# Altium schematic sheet MCU - FLASH.SchDoc
size A4; SheetNumber: 7; SheetTotal: 8
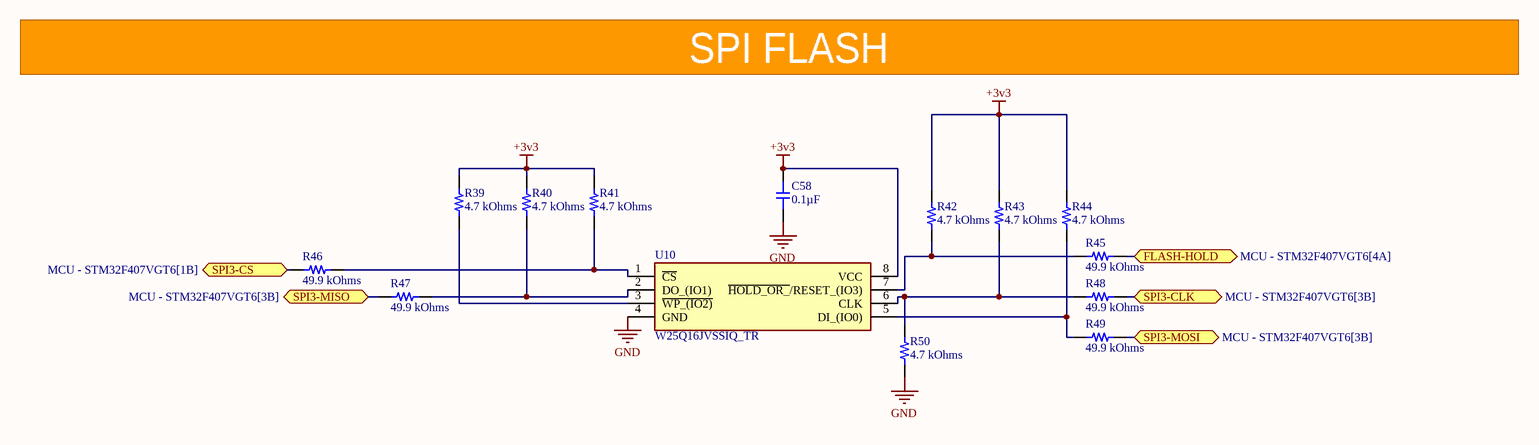
[diagram p0: MCU - FLASH.SchDoc]

## Parts
C58  0.1µF  [0603_Footprint]
R39  4.7 kOhms  [0603_RES]
R40  4.7 kOhms  [0603_RES]
R41  4.7 kOhms  [0603_RES]
R42  4.7 kOhms  [0603_RES]
R43  4.7 kOhms  [0603_RES]
R44  4.7 kOhms  [0603_RES]
R45  49.9 kOhms  [0603_RES]
R46  49.9 kOhms  [0603_RES]
R47  49.9 kOhms  [0603_RES]
R48  49.9 kOhms  [0603_RES]
R49  49.9 kOhms  [0603_RES]
R50  4.7 kOhms  [0603_RES]
U10  W25Q16JVSSIQ_TR  [SOIC127P790X216-8N]

## Ports
FLASH-HOLD (bidir, see MCU - STM32F407VGT6[4A]), SPI3-CLK (bidir, see MCU - STM32F407VGT6[3B]), SPI3-CS (bidir, see MCU - STM32F407VGT6[1B]), SPI3-MISO (bidir, see MCU - STM32F407VGT6[3B]), SPI3-MOSI (bidir, see MCU - STM32F407VGT6[3B])

## Nets
+3v3: C58.1 R39.2 R40.2 R41.2 R42.2 R43.2 R44.2 U10.8(VCC)
GND: C58.2 R50.1 U10.4(GND)
FLASH-HOLD: R45.2 ; port FLASH-HOLD
SPI3-CLK: R48.2 ; port SPI3-CLK
SPI3-CS: R46.1 ; port SPI3-CS
SPI3-MISO: R47.1 ; port SPI3-MISO
SPI3-MOSI: R49.2 ; port SPI3-MOSI
NetR39_1: R39.1 U10.3(~{WP_(IO2)})
NetR40_1: R40.1 R47.2 U10.2(DO_(IO1))
NetR41_1: R41.1 R46.2 U10.1(~{CS})
NetR42_1: R42.1 R45.1 U10.7(~{HOLD_OR_}/RESET_(IO3))
NetR43_1: R43.1 R48.1 R50.2 U10.6(CLK)
NetR44_1: R44.1 R49.1 U10.5(DI_(IO0))

## Notes on the sheet
- SPI FLASH

## Library data of the parts
C58 = 0.1uF 0603 Surface Capacitor
R39-R44 R50 = 4.7 kOhms 0603
R45-R49 = 49.9 kOhms 0603
U10 = W25Q16JVSSIQ_TR: Integrated Circuit; Manufacturer_Name: Winbond; Manufacturer_Part_Number: W25Q16JVSSIQ TR; Datasheet Link: https://www.winbond.com/resource-files/w25q16jv%20spi%20revg%2003222018%20plus.pdf; Height: 2.16mm; Mouser Part Number: 454-W25Q16JVSSIQTR; Mouser Price/Stock: https://www.mouser.co.uk/ProductDetail/Winbond/W25Q16JVSSIQ-TR?qs=qSfuJ%252Bfl%2Fd6oXlsNm7Svfg%3D%3D; Arrow Part Number: W25Q16JVSSIQ TR; Arrow Price/Stock: https://www.arrow.com/en/products/w25q16jvssiqtr/winbond-electronics?region=nac